# Altium project panda_band2Gen.PrjPCB
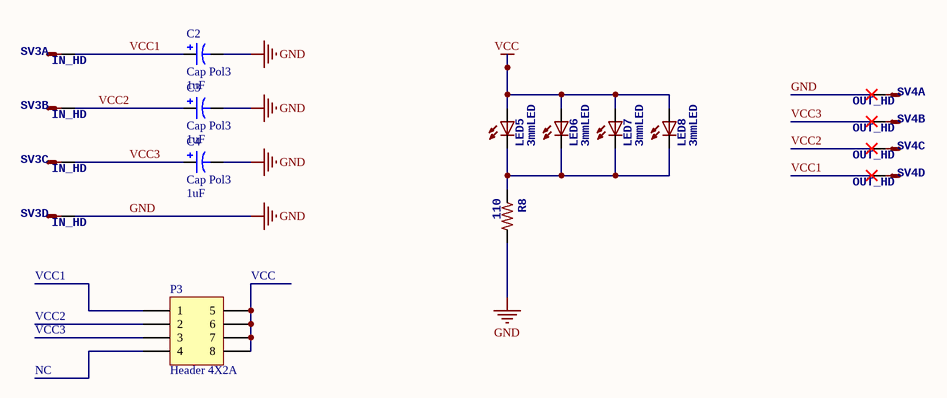
[diagram p0: node_simple.SchDoc]
2 sheets, 31 parts. Net scope: global (net labels, ports and power ports of the same name join across sheets).
Board files: node_simple.PcbDoc, node.PcbDoc
Sheets:
  node_simple.SchDoc
  node.SchDoc

## Sheet node_simple.SchDoc
size A

### Parts
C2  Cap Pol3  value 1uF  [C0805]
C3  Cap Pol3  value 1uF  [C0805]
C4  Cap Pol3  value 1uF  [C0805]
LED5  3mmLED  [LED3MM]
LED6  3mmLED  [LED3MM]
LED7  3mmLED  [LED3MM]
LED8  3mmLED  [LED3MM]
P3  Header 4X2A  [HDR2X4_CEN]
R8  110  [M0805]
SV3  IN_HD  [L04P]  (parts A,B,C,D of 4)
SV4  OUT_HD  [L04P]  (parts A,B,C,D of 4)

### Nets
GND: C2.2 C3.2 C4.2 R8.2 SV3.4(S) SV4.1(S)
VCC: LED5.A LED6.A LED7.A LED8.A
VCC1: C2.1 SV3.1(S) SV4.4(S)
VCC2: C3.1 SV3.2(S) SV4.3(S)
VCC3: C4.1 SV3.3(S) SV4.2(S)
NetLED5_K: LED5.K(C) LED6.K(C) LED7.K(C) LED8.K(C) R8.1
NetP3_5: P3.5 P3.6 P3.7 P3.8

Not connected (* = marked no-connect by the designer): P3 1 2 3 4

### Notes on the sheet
- VCC1
- VCC2
- (near P3) VCC
- VCC3
- NC

### Library data of the parts
C2-C4 = Cap Pol3: Polarized Capacitor (Surface Mount); Published: 8-Jun-2000; LatestRevisionDate: 29-May-2009; LatestRevisionNote: IPC-7351 Footprint Added.; PackageReference: C0805; Publisher: Altium Limited; PackageDescription: Chip Capacitor
LED5-LED8 = LED3MM
P3 = Header 4X2A: Header, 4-Pin, Dual row; LatestRevisionDate: 17-Jul-2002; LatestRevisionNote: Re-released for DXP Platform.; Publisher: Altium Limited
R8 = R-US_M0805: R-M0805; value: 4.7k
SV3 SV4 = L04P: OC_FARNELL: unknown; OC_NEWARK: unknown

## Sheet node.SchDoc: Snake-band
size A; CompanyName: Team PAPA; DrawnBy: Hengjiu Kang; Organization: Team PAPA; Revision: 0.1; SheetNumber: 1; DocumentName: snake-band
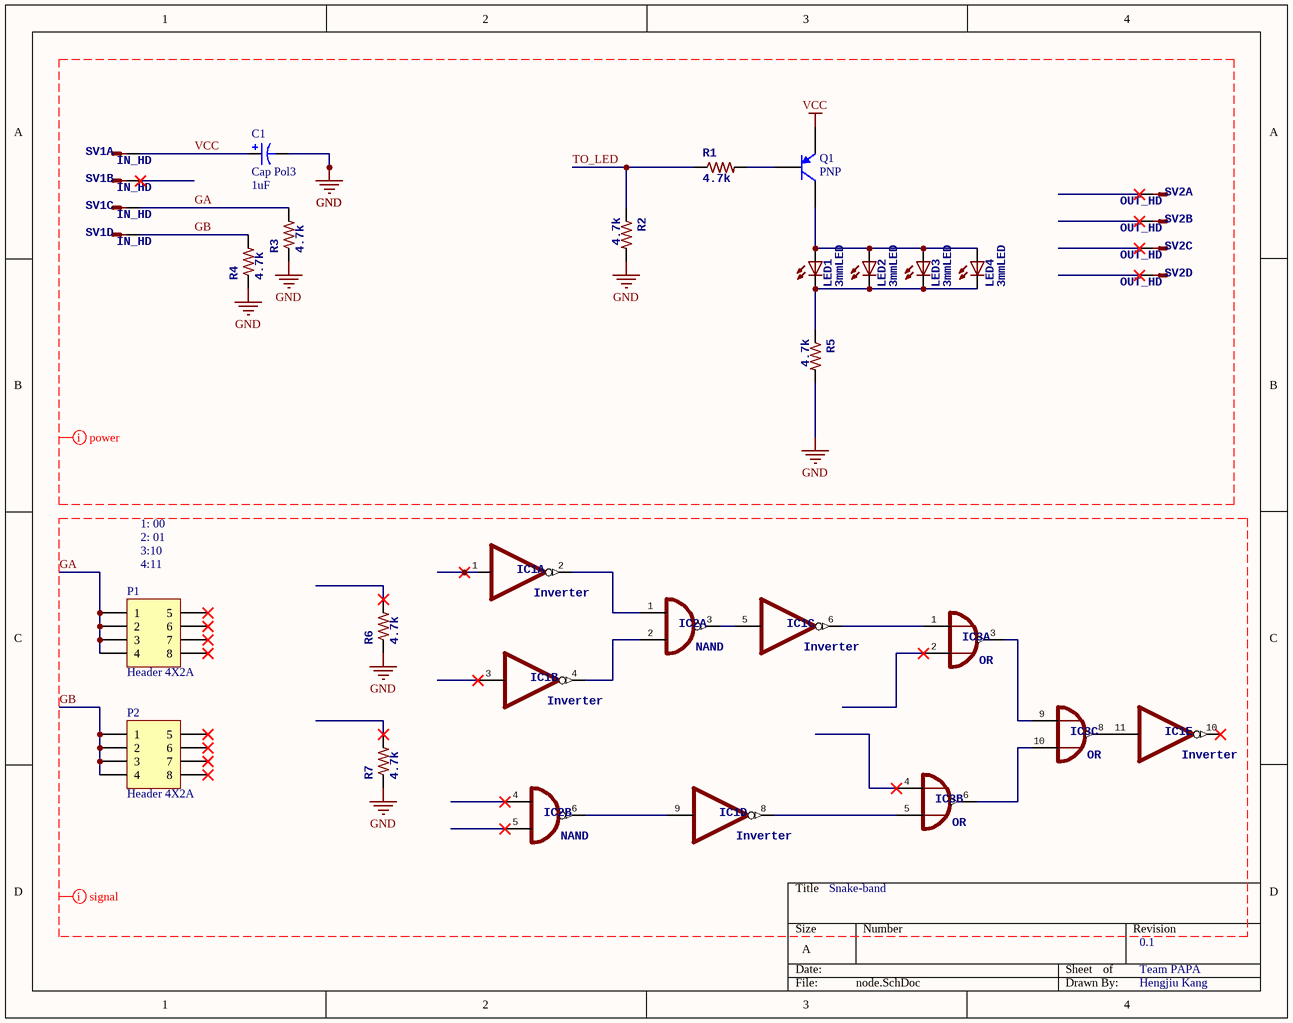
[diagram p1: node.SchDoc]

### Parts
C1  Cap Pol3  value 1uF  [C0805]
IC1  Inverter  [ssop14]  (parts A,B,C,D,E of 7)
IC2  NAND  [SSOP14]  (parts A,B of 5)
IC3  OR  [ssop14]  (parts A,B,C of 5)
LED1  3mmLED  [LED3MM]
LED2  3mmLED  [LED3MM]
LED3  3mmLED  [LED3MM]
LED4  3mmLED  [LED3MM]
P1  Header 4X2A  [HDR2X4_CEN]
P2  Header 4X2A  [HDR2X4_CEN]
Q1  PNP  [SOT-23B_N]
R1  4.7k  [M0805]
R2  4.7k  [M0805]
R3  4.7k  [M0805]
R4  4.7k  [M0805]
R5  4.7k  [M0805]
R6  4.7k  [M0805]
R7  4.7k  [M0805]
SV1  IN_HD  [L04P]  (parts A,B,C,D of 4)
SV2  OUT_HD  [L04P]  (parts A,B,C,D of 4)

### Nets
GND: C1.2 R2.2 R3.1 R4.1 R5.2 R6.1 R7.1
VCC: C1.1 Q1.3(E) SV1.1(S)
GA: P1.1 P1.2 P1.3 P1.4 R3.2 SV1.3(S)
GB: P2.1 P2.2 P2.3 P2.4 R4.2 SV1.4(S)
TO_LED: R1.1 R2.1
NetIC1_2: IC1.2(O) IC2.1(I0)
NetIC1_4: IC1.4(O) IC2.2(I1)
NetIC1_5: IC1.5(I) IC2.3(O)
NetIC1_6: IC1.6(O) IC3.1(I0)
NetIC1_8: IC1.8(O) IC3.5(I1)
NetIC1_9: IC1.9(I) IC2.6(O)
NetIC1_11: IC1.11(I) IC3.8(O)
NetIC3_3: IC3.3(O) IC3.9(I0)
NetIC3_6: IC3.6(O) IC3.10(I1)
NetLED1_A: LED1.A LED2.A LED3.A LED4.A Q1.1(C)
NetLED1_K: LED1.K(C) LED2.K(C) LED3.K(C) LED4.K(C) R5.1
NetQ1_2: Q1.2(B) R1.2

Not connected (* = marked no-connect by the designer): IC1 1(I)* 3(I)* 10(O)*; IC2 4(I0)* 5(I1)*; IC3 2(I1)* 4(I0)*; P1 5* 6* 7* 8*; P2 5* 6* 7* 8*; R6 2*; R7 2*; SV1 2(S)*; SV2 1(S)* 2(S)* 3(S)* 4(S)*

### Layout directives
net class power: GA, GB, GND, TO_LED, VCC
net class signal: GA, GB, GND

### Notes on the sheet
- 1: 00
- 2: 01
- 3:10
- (near P1) 4:11

### Library data of the parts
C1 = Cap Pol3: Polarized Capacitor (Surface Mount); Published: 8-Jun-2000; LatestRevisionDate: 29-May-2009; LatestRevisionNote: IPC-7351 Footprint Added.; PackageReference: C0805; Publisher: Altium Limited; PackageDescription: Chip Capacitor
IC1 = 74*04DB: FULL_Name: Hex <b>INVERTER</b>; ID: Inverter
IC2 = 74*00DB: FULL_NAME: Quad 2-input NAND; ID: NAND
IC3 = 74*32DB: FULL_Name: Quad 2-input <b>OR</b> gate; ID: OR
LED1-LED4 = LED3MM
P1 P2 = Header 4X2A: Header, 4-Pin, Dual row; LatestRevisionDate: 17-Jul-2002; LatestRevisionNote: Re-released for DXP Platform.; Publisher: Altium Limited
Q1 = PNP: PNP Bipolar Transistor; Published: 8-Jun-2000; LatestRevisionDate: 29-May-2009; LatestRevisionNote: IPC-7351 Footprint Added.; PackageVersion: Aug-1999; PackageReference: SOT-23B; Publisher: Altium Limited; PackageDescription: 3-Pin SOT-23 Package 0.95 mm Pitch, 2.4 mm Lead Span
R1-R6 = R-US_M0805: R-M0805; value: 4.7k
R7 = R-US_M0805: value: 4.7k
SV1 SV2 = L04P: OC_FARNELL: unknown; OC_NEWARK: unknown

## Nets that join several sheets
GND: node_simple (6 pins), node (7 pins)
VCC: node_simple (LED5.A LED6.A LED7.A LED8.A), node (C1.1 Q1.3 SV1.1)